# EAGLE schematic rfduino (EAGLE 7.5.0)
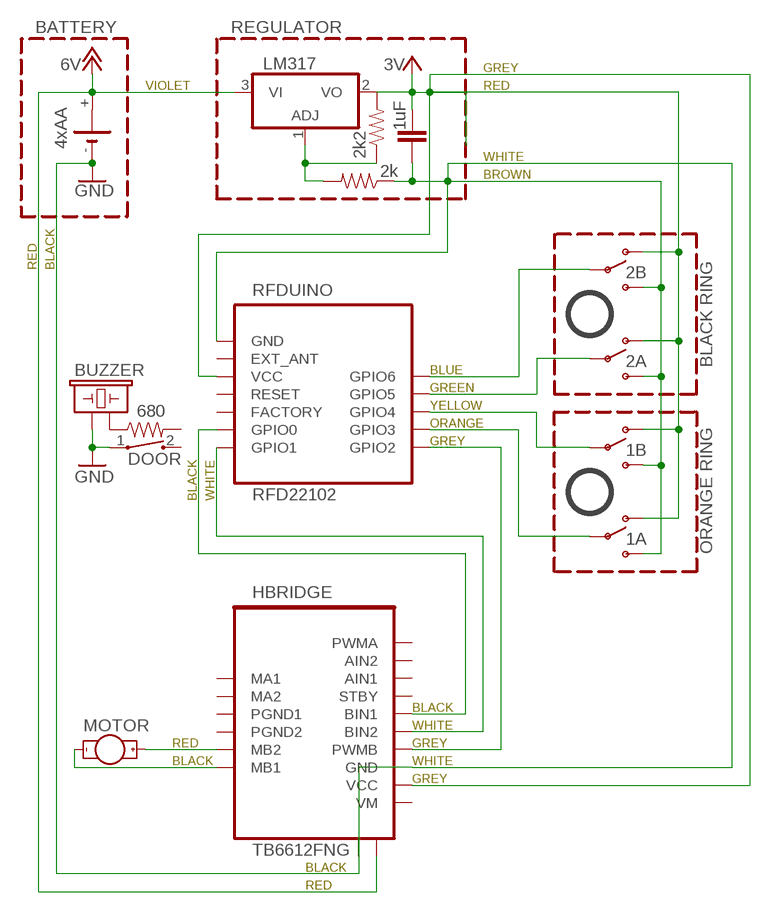
[diagram p0: schematic, sheet 1]

## Parts
1A  1A  SWITCH-SPDTPTH_LOCK  [SWITCH-SPDT_LOCK.007S]
1B-  1B  SWITCH-SPDTPTH_LOCK  [SWITCH-SPDT_LOCK.007S]
2A  2A  SWITCH-SPDTPTH_LOCK  [SWITCH-SPDT_LOCK.007S]
2B  2B  SWITCH-SPDTPTH_LOCK  [SWITCH-SPDT_LOCK.007S]
BAT  4xAA  CRAA  [CRAA]
BUZZER  BUZZERPTH  [BUZZER-12MM]
C2  1uF  CAPPTH  [CAP-PTH-SMALL]
DOOR  CT10-XXXX-A2  [CT10-XXXX-A2]
HBRIDGE  TB6612FNG  [SSOP24]
LM317  317T  [TO220H]
MOTOR  MOTOR10MM  [VIBE-MOTOR-10MM]
R1  680  680OHM1/10W5%(0603)  [0603-RES]
R2  2k  RESISTOREZ  [AXIAL-0.3EZ]
R3  2k2  RESISTOREZ  [AXIAL-0.3EZ]
RFDUINO  RFD22102  [RFD22102]

## Nets
1A: 1A.2(P)
1B: 1B-.2(P)
2A: 2A.2(P)
2B: 2B.2(P)
+3V3: 1A.1(O) 1B-.1(O) 2A.1(O) 2B.1(O) C2.2 HBRIDGE.20(VCC) LM317.2(VO) R3.P$2 RFDUINO.VCC ; supply symbol labelled 3V
+6V: BAT.+ HBRIDGE.13(VM+) LM317.3(VI) ; supply symbol labelled 6V
BIN1: HBRIDGE.17(BIN1) RFDUINO.GPIO0
BIN2: HBRIDGE.16(BIN2) RFDUINO.GPIO1
BLACK_GND: BUZZER.+ DOOR.1 ; supply symbol labelled GND
BLACK_OUT: HBRIDGE.11(MB1) MOTOR.-
GND: 1A.3(S) 1B-.3(S) 2A.3(S) 2B.3(S) BAT.- C2.1 HBRIDGE.10(VM-) HBRIDGE.18(GND) R2.P$1 RFDUINO.GND
MB2: HBRIDGE.7(MB2) MOTOR.+
N$1: LM317.1(ADJ) R2.P$2 R3.P$1
N$4: BUZZER.- R1.1
PWMB: HBRIDGE.15(PWMB) RFDUINO.GPIO2
Unconnected: BAT.+@1(+) DOOR.2 HBRIDGE.1(MA1) HBRIDGE.5(MA2) HBRIDGE.19(STBY) HBRIDGE.21(AIN1) HBRIDGE.22(AIN2) HBRIDGE.23(PWMA) R1.2 RFDUINO.EXT_ANT RFDUINO.FACTORY RFDUINO.GPIO3 RFDUINO.GPIO4 RFDUINO.GPIO5 RFDUINO.GPIO6 RFDUINO.RESET

## Notes on the sheet
- BATTERY | REGULATOR
- GREY
- VIOLET | RED
- WHITE
- BROWN
- BLACK RING
- RED | BLACK
- BLUE
- GREEN
- YELLOW
- ORANGE
- GREY
- BLACK | WHITE
- ORANGE RING
- BLACK
- WHITE
- RED | GREY
- BLACK | WHITE
- GREY
- BLACK
- RED

## Power pins joined to a net without a drawn wire
PGND1: HBRIDGE.3(PGND1)
PGND2: HBRIDGE.9(PGND2)
VM: HBRIDGE.24(VM)

## Library data of the parts
1A 1B- 2A 2B = SparkFun-Electromechanical:SWITCH-SPDT: SPDT Switch Simple slide switch, Spark Fun Electronics SKU : COM-00102 DPDT SMT slide switch, AYZ0202, SWCH-08179
BAT = battery:CRAA: LI BATTERY Varta
BUZZER = SparkFun-Electromechanical:BUZZER: Buzzer 12mm Spark Fun Electronics SKU : Comp-Buzzer
C2 = SparkFun-Passives:CAP: Capacitor Standard 0603 ceramic capacitor, and 0.1" leaded capacitor.
DOOR = switch-coto:CT10-XXXX-: CT10 Series Molded Switch Source: www.cotorelay.com .. Coto_Technology__CT10-1530-G1.pdf
HBRIDGE = SparkFun-PowerIC:TB6612FNG: Toshiba 1A dual motor driver IC-09363; PROD_ID: IC-09363
LM317 = linear:*317: Positive VOLTAGE REGULATOR
MOTOR = SparkFun-Electromechanical:MOTOR: Vibration Motor- ROB-08449 Physical dimension and wire connections for this powerful vibration motor. Motor has a self adhesive backing.
R1 = SparkFun-Resistors:680OHM1/10W5%(0603): RES-09333; PROD_ID: RES-09333
R2 R3 = SparkFun-Passives:RESISTOR: Resistor Basic schematic elements and footprints for 0603, 1206, and PTH resistors.
RFDUINO = RF_Digital_RFD22102_Eagle_Schematic_PCB_Library:RFD22102: RFD22102 RFduino DIP module RFduino Datasheet: http://www.rfdigital.com/wp-content/uploads/2014/03/rfduino.datasheet.pdf